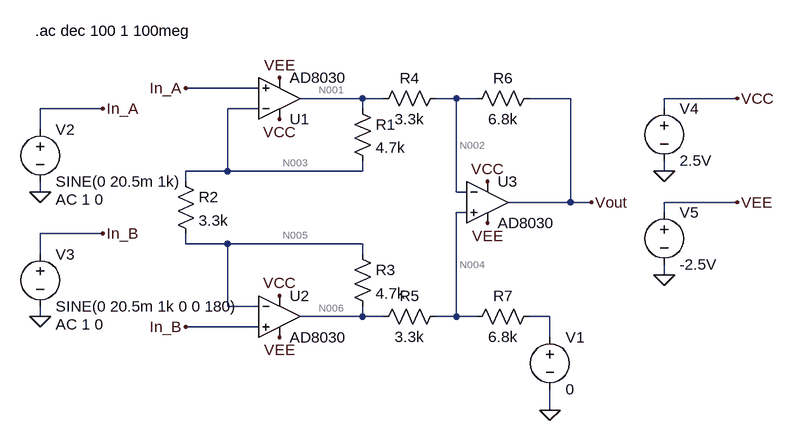
[diagram p0: schematic Etaj1_ac_CMRR.asc]
Etaj1_ac_CMRR.asc, the LTspice schematic file:
Version 4.1
SHEET 1 976 680
WIRE 112 48 0 48
WIRE 272 64 176 64
WIRE 304 64 272 64
WIRE 416 64 384 64
WIRE 448 64 416 64
WIRE 592 64 528 64
WIRE 848 64 736 64
WIRE -128 80 -224 80
WIRE 112 80 64 80
WIRE 272 80 272 64
WIRE 736 80 736 64
WIRE -224 112 -224 80
WIRE 64 176 64 80
WIRE 64 176 0 176
WIRE 272 176 272 160
WIRE 272 176 64 176
WIRE 736 176 736 160
WIRE 0 192 0 176
WIRE -224 208 -224 192
WIRE 416 208 416 64
WIRE 432 208 416 208
WIRE 592 224 592 64
WIRE 592 224 496 224
WIRE 624 224 592 224
WIRE 848 224 736 224
WIRE 432 240 416 240
WIRE 736 240 736 224
WIRE -128 272 -224 272
WIRE 0 288 0 272
WIRE 64 288 0 288
WIRE 272 288 64 288
WIRE -224 304 -224 272
WIRE 272 304 272 288
WIRE 736 336 736 320
WIRE 64 384 64 288
WIRE 112 384 64 384
WIRE -224 400 -224 384
WIRE 272 400 272 384
WIRE 272 400 176 400
WIRE 304 400 272 400
WIRE 416 400 416 240
WIRE 416 400 384 400
WIRE 448 400 416 400
WIRE 560 400 528 400
WIRE 112 416 0 416
WIRE 560 432 560 400
WIRE 560 544 560 512
FLAG 560 544 0
FLAG -224 400 0
FLAG -224 208 0
FLAG -128 80 In_A
FLAG 0 48 In_A
FLAG -128 272 In_B
FLAG 0 416 In_B
FLAG 624 224 Vout
FLAG 144 96 VCC
FLAG 464 192 VCC
FLAG 144 368 VCC
FLAG 144 32 VEE
FLAG 464 256 VEE
FLAG 144 432 VEE
FLAG 736 336 0
FLAG 736 176 0
FLAG 848 64 VCC
FLAG 848 224 VEE
SYMBOL OpAmps\\AD8030 144 128 M180
SYMATTR InstName U1
SYMBOL OpAmps\\AD8030 144 336 R0
SYMATTR InstName U2
SYMBOL OpAmps\\AD8030 464 160 R0
SYMATTR InstName U3
SYMBOL res 256 64 R0
SYMATTR InstName R1
SYMATTR Value 4.7k
SYMBOL res -16 176 R0
SYMATTR InstName R2
SYMATTR Value 3.3k
SYMBOL res 256 288 R0
SYMATTR InstName R3
SYMATTR Value 4.7k
SYMBOL res 400 48 R90
WINDOW 0 0 56 VBottom 2
WINDOW 3 32 56 VTop 2
SYMATTR InstName R4
SYMATTR Value 3.3k
SYMBOL res 400 384 R90
WINDOW 0 0 56 VBottom 2
WINDOW 3 32 56 VTop 2
SYMATTR InstName R5
SYMATTR Value 3.3k
SYMBOL res 544 48 R90
WINDOW 0 0 56 VBottom 2
WINDOW 3 32 56 VTop 2
SYMATTR InstName R6
SYMATTR Value 6.8k
SYMBOL res 544 384 R90
WINDOW 0 0 56 VBottom 2
WINDOW 3 32 56 VTop 2
SYMATTR InstName R7
SYMATTR Value 6.8k
SYMBOL voltage 560 416 R0
WINDOW 123 0 0 Left 0
WINDOW 39 0 0 Left 0
SYMATTR InstName V1
SYMATTR Value 0
SYMBOL voltage -224 96 R0
WINDOW 123 24 124 Left 2
WINDOW 39 0 0 Left 0
SYMATTR Value2 AC 1 0
SYMATTR InstName V2
SYMATTR Value SINE(0 20.5m 1k)
SYMBOL voltage -224 288 R0
WINDOW 123 24 124 Left 2
WINDOW 39 0 0 Left 0
SYMATTR Value2 AC 1 0
SYMATTR InstName V3
SYMATTR Value SINE(0 20.5m 1k 0 0 180)
SYMBOL voltage 736 64 R0
WINDOW 123 24 124 Left 2
WINDOW 39 0 0 Left 0
SYMATTR InstName V4
SYMATTR Value 2.5V
SYMBOL voltage 736 224 R0
WINDOW 123 0 0 Left 0
WINDOW 39 0 0 Left 0
SYMATTR InstName V5
SYMATTR Value -2.5V
TEXT -232 -40 Left 2 !.ac dec 100 1 100meg

The netlist it stands for:
* Etaj1_ac_CMRR.asc
X§U1 In_A N003 VCC VEE N001 AD8040  ; AD8030, pins In+ In- V+ V- OUT
X§U2 In_B N005 VCC VEE N006 AD8040  ; AD8030, pins In+ In- V+ V- OUT
X§U3 N004 N002 VCC VEE Vout AD8040  ; AD8030, pins In+ In- V+ V- OUT
R1 N001 N003 4.7k
R2 N003 N005 3.3k
R3 N005 N006 4.7k
R4 N002 N001 3.3k
R5 N004 N006 3.3k
R6 Vout N002 6.8k
R7 N007 N004 6.8k
V1 N007 0 0
V2 In_A 0 SINE(0 20.5m 1k) AC 1 0
V3 In_B 0 SINE(0 20.5m 1k 0 0 180) AC 1 0
V4 VCC 0 2.5V
V5 VEE 0 -2.5V
.ac dec 100 1 100meg
.lib ADI.lib
.backanno
.end

* Results of the author's LTspice run, read from the files saved beside the schematic
* Operating Point, zero values left out:
*   V(n001) = -7.989 mV
*   V(n002) = -1.601 mV
*   V(n003) = 743.3 nV
*   V(n004) = -1.601 mV
*   V(n005) = 743.3 nV
*   V(n006) = -7.989 mV
*   V(vcc) = 2.5 V
*   V(vee) = -2.5 V
*   V(vout) = -141.4 nV
*   I(R1) = -1.7 µA
*   I(R3) = 1.7 µA
*   I(R4) = 1.936 µA
*   I(R5) = 1.936 µA
*   I(R6) = 235.5 nA
*   I(R7) = 235.5 nA
*   I(V1) = -235.5 nA
*   I(V2) = 1.7 µA
*   I(V3) = 1.7 µA
*   I(V4) = -3.831 mA
*   I(V5) = 3.828 mA
*   Ix(u1:1) = -1.7 µA
*   Ix(u1:2) = -1.7 µA
*   Ix(u1:3) = 1.277 mA
*   Ix(u1:4) = -1.277 mA
*   Ix(u1:5) = 3.636 µA
*   Ix(u2:1) = -1.7 µA
*   Ix(u2:2) = -1.7 µA
*   Ix(u2:3) = 1.277 mA
*   Ix(u2:4) = -1.277 mA
*   Ix(u2:5) = 3.636 µA
*   Ix(u3:1) = -1.7 µA
*   Ix(u3:2) = -1.7 µA
*   Ix(u3:3) = 1.277 mA
*   Ix(u3:4) = -1.273 mA
*   Ix(u3:5) = -235.5 nA
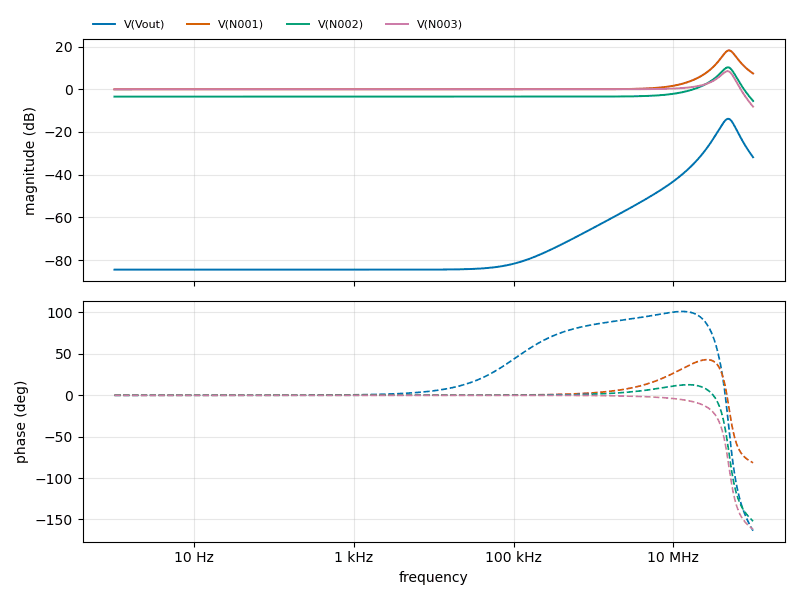
[diagram p1: AC Analysis of Etaj1_ac_CMRR.asc, plotted from the saved traces]
* AC Analysis, 1 run:
*   V(Vout): -84.51 dB at 1 Hz, -31.83 dB at 100 MHz, peak -13.82 dB at 48.98 MHz, 3 dB below the peak at 40.51 MHz and 57.89 MHz
*   V(N001): 0.01 dB at 1 Hz, 7.41 dB at 100 MHz, peak 18.22 dB at 50.12 MHz, 3 dB below the peak at 40.69 MHz and 61.22 MHz
*   V(N002): -3.43 dB at 1 Hz, -5.46 dB at 100 MHz, peak 10.27 dB at 48.98 MHz, 3 dB below the peak at 38.23 MHz and 58.25 MHz
*   V(N003): -0.00 dB at 1 Hz, -8.14 dB at 100 MHz, peak 8.51 dB at 47.86 MHz, 3 dB below the peak at 36.64 MHz and 57.56 MHz